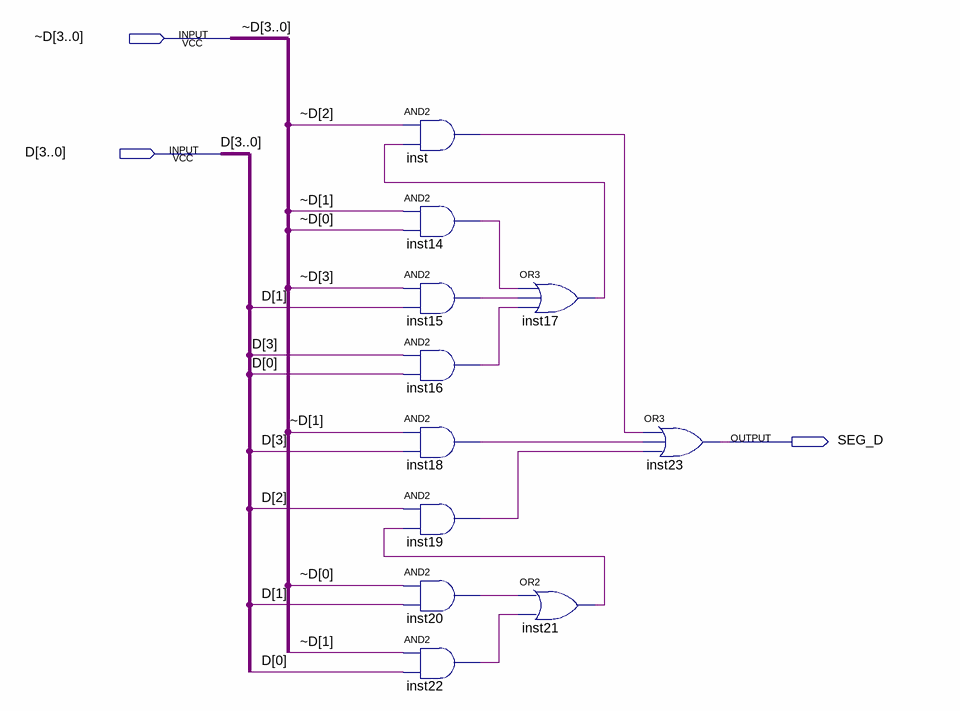
[diagram p0: schematic sheet]
// Quartus schematic SEG_D.bdf as structural Verilog: 11 symbols, 3 pins
module SEG_D (
  input  [3:0] \~D ,
  input  [3:0] D,
  output SEG_D
);

  wire inst14_out, inst15_out, inst16_out, inst17_out, inst18_out, inst19_out, inst20_out, inst21_out,
       inst22_out, inst_out;

  and inst (inst_out, \~D [2], inst17_out);
  and inst14 (inst14_out, \~D [1], \~D [0]);
  and inst15 (inst15_out, \~D [3], D[1]);
  and inst16 (inst16_out, D[3], D[0]);
  and inst18 (inst18_out, \~D [1], D[3]);
  and inst19 (inst19_out, D[2], inst21_out);
  and inst20 (inst20_out, \~D [0], D[1]);
  and inst22 (inst22_out, \~D [1], D[0]);
  or inst17 (inst17_out, inst14_out, inst15_out, inst16_out);
  or inst21 (inst21_out, inst20_out, inst22_out);
  or inst23 (SEG_D, inst_out, inst18_out, inst19_out);
endmodule
